# EAGLE design masterboard (EAGLE 7.0.0)
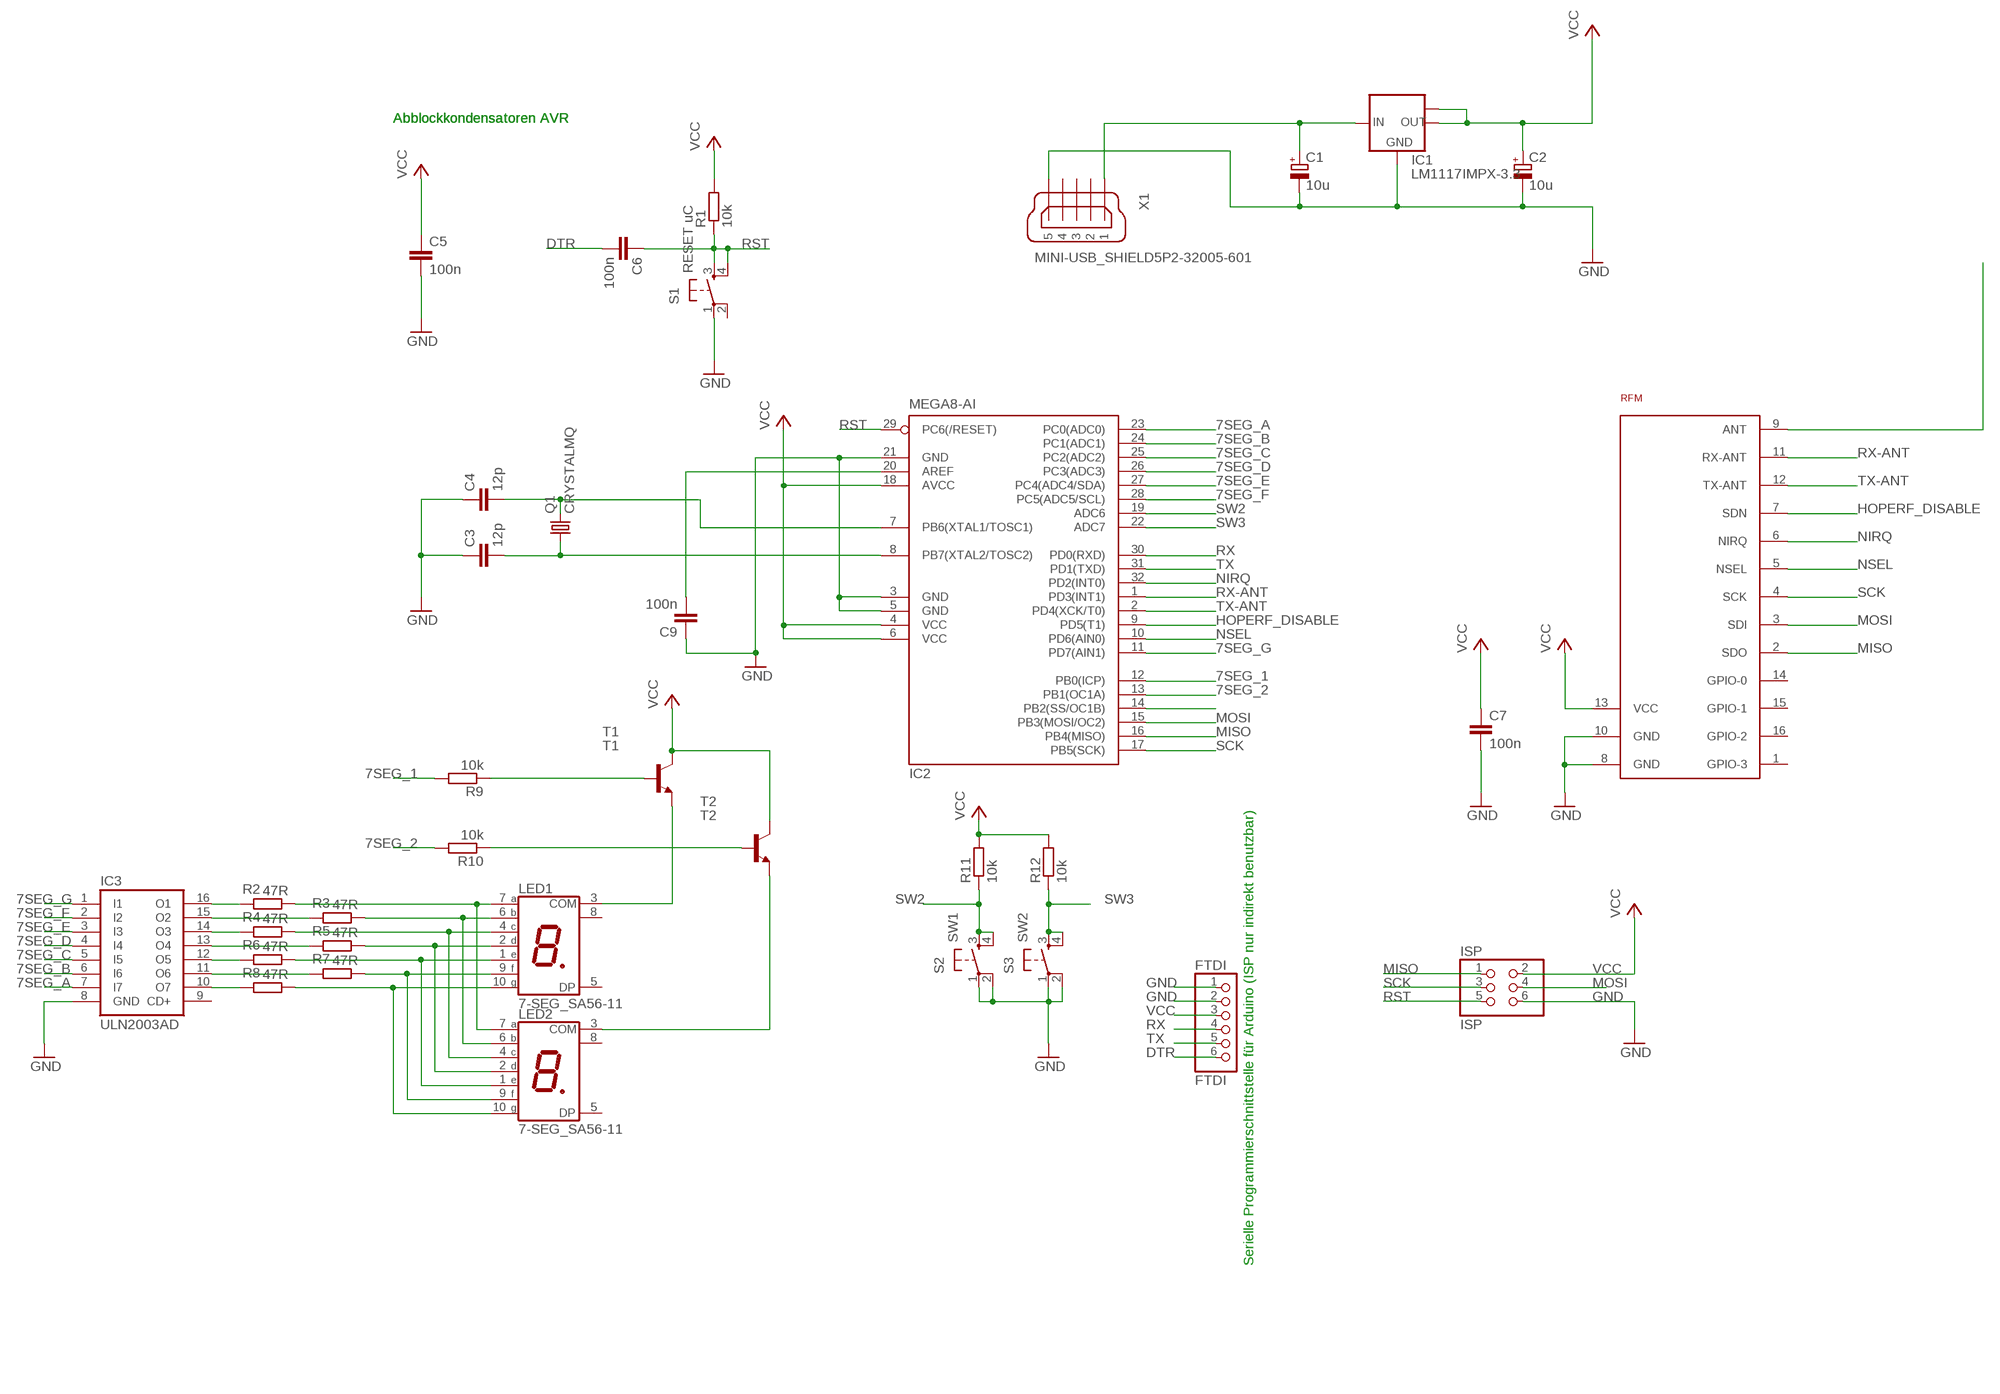
[diagram p0: schematic, sheet 1]

## Parts
C1  10u  CPOL-EUCT6032  [CT6032]
C2  10u  CPOL-EUCT6032  [CT6032]
C3  12p  C-EUC0603  [C0603]
C4  12p  C-EUC0603  [C0603]
C5  100n  C-EUC0603  [C0603]
C6  100n  C-EUC0603  [C0603]
C7  100n  C-EUC0603  [C0603]
C9  100n  C-EUC0603  [C0603]
FTDI  FTDI  PINHD-1X6/90  [1X06/90]
IC1  LM1117IMPX-3.3  [SOT223]
IC2  MEGA8-AI  [TQFP32-08]
IC3  ULN2003AD  [SO16]
ISP  ISP  PINHD-2X3  [2X03]
LED1  7-SEG_SA56-11  [SA56-11]
LED2  7-SEG_SA56-11  [SA56-11]
Q1  CRYSTALMQ  [MQ]
R1  10k  R-EU_R0805  [R0805]
R2  47R  R-EU_R0805  [R0805]
R3  47R  R-EU_R0805  [R0805]
R4  47R  R-EU_R0805  [R0805]
R5  47R  R-EU_R0805  [R0805]
R6  47R  R-EU_R0805  [R0805]
R7  47R  R-EU_R0805  [R0805]
R8  47R  R-EU_R0805  [R0805]
R9  10k  R-EU_R0805  [R0805]
R10  10k  R-EU_R0805  [R0805]
R11  10k  R-EU_R0805  [R0805]
R12  10k  R-EU_R0805  [R0805]
RFM  HOPERF-DB  [HOPERF-DB]
S1  RESET uC  10-XXB3FRAFI  [RAFI]
S2  SW1  10-XXB3FRAFI  [RAFI]
S3  SW2  10-XXB3FRAFI  [RAFI]
T1  T1  BCX54-NPN-SOT89-BCE  [SOT89-BCE]
T2  T2  BCX54-NPN-SOT89-BCE  [SOT89-BCE]
X1  MINI-USB_SHIELD5P2-32005-601  [32005-601]

## Nets
7SEG_1: IC2.12(PB0(ICP)) R9.2
7SEG_2: IC2.13(PB1(OC1A)) R10.2
7SEG_A: IC2.23(PC0(ADC0)) IC3.7(I7)
7SEG_B: IC2.24(PC1(ADC1)) IC3.6(I6)
7SEG_C: IC2.25(PC2(ADC2)) IC3.5(I5)
7SEG_D: IC2.26(PC3(ADC3)) IC3.4(I4)
7SEG_E: IC2.27(PC4(ADC4/SDA)) IC3.3(I3)
7SEG_F: IC2.28(PC5(ADC5/SCL)) IC3.2(I2)
7SEG_G: IC2.11(PD7(AIN1)) IC3.1(I1)
DTR: C6.2 FTDI.6
GND: C1.- C2.- C3.1 C4.1 C5.2 C7.2 C9.1 FTDI.1 FTDI.2 IC1.1(GND) IC2.3(GND) IC2.5(GND) IC2.21(GND) IC3.8(GND) ISP.6 RFM.8(GND) RFM.10(GND) S1.1(P) S2.1(P) S2.2(P1) S3.1(P) S3.2(P1) X1.5
HOPERF_DISABLE: IC2.9(PD5(T1)) RFM.7(SDN)
MISO: IC2.16(PB4(MISO)) ISP.1 RFM.2(SDO)
MOSI: IC2.15(PB3(MOSI/OC2)) ISP.4 RFM.3(SDI)
N$1: C3.2 IC2.8(PB7(XTAL2/TOSC2)) Q1.P1
N$2: C4.2 IC2.7(PB6(XTAL1/TOSC1)) Q1.P3
N$3: C1.+ IC1.3(IN) X1.1
N$4: IC2.14(PB2(SS/OC1B))
N$5: C9.2 IC2.20(AREF)
N$8: IC3.16(O1) R2.2
N$9: LED1.7(A) LED2.7(A) R2.1
N$10: IC3.15(O2) R3.2
N$11: LED1.6(B) LED2.6(B) R3.1
N$12: IC3.14(O3) R4.2
N$13: LED1.4(C) LED2.4(C) R4.1
N$14: IC3.13(O4) R5.2
N$15: LED1.2(D) LED2.2(D) R5.1
N$16: IC3.12(O5) R6.2
N$17: LED1.1(E) LED2.1(E) R6.1
N$18: IC3.11(O6) R7.2
N$19: LED1.9(F) LED2.9(F) R7.1
N$20: IC3.10(O7) R8.2
N$21: LED1.10(G) LED2.10(G) R8.1
N$22: LED1.3(COM) T1.E
N$24: LED2.3(COM) T2.E
N$25: R10.1 T2.B
N$26: R9.1 T1.B
N$35: RFM.9(ANT)
NIRQ: IC2.32(PD2(INT0)) RFM.6(NIRQ)
NSEL: IC2.10(PD6(AIN0)) RFM.5(NSEL)
RST: C6.1 IC2.29(PC6(/RESET)) ISP.5 R1.1 S1.3(S) S1.4(S1)
RX: FTDI.4 IC2.30(PD0(RXD))
RX-ANT: IC2.1(PD3(INT1)) RFM.11(RX-ANT)
SCK: IC2.17(PB5(SCK)) ISP.3 RFM.4(SCK)
SW2: IC2.19(ADC6) R11.1 S2.3(S) S2.4(S1)
SW3: IC2.22(ADC7) R12.1 S3.3(S) S3.4(S1)
TX: FTDI.5 IC2.31(PD1(TXD))
TX-ANT: IC2.2(PD4(XCK/T0)) RFM.12(TX-ANT)
VCC: C2.+ C5.1 C7.1 FTDI.3 IC1.2(OUT) IC1.TAB(OUT1) IC2.4(VCC) IC2.6(VCC) IC2.18(AVCC) ISP.2 R1.2 R11.2 R12.2 RFM.13(VCC) T1.C T2.C
Unconnected: IC3.9(CD+) LED1.5(DP) LED1.8(COM) LED2.5(DP) LED2.8(COM) Q1.P2(GND) Q1.P4(GND1) RFM.1(GPIO-3) RFM.14(GPIO-0) RFM.15(GPIO-1) RFM.16(GPIO-2) S1.2(P1) X1.2 X1.3 X1.4 X1.M1(S1) X1.M2(S2)

## Notes on the sheet
- Abblockkondensatoren AVR | Abblockkondensatoren AVR
- Serielle Programmierschnittstelle für Arduino (ISP nur indirekt benutzbar)

## Library data of the parts
C1 C2 = rcl:CPOL-EU: POLARIZED CAPACITOR, European symbol
C3-C7 C9 = rcl:C-EU: CAPACITOR, European symbol
FTDI = pinhead:PINHD-1X6: PIN HEADER
IC1 = lm1117:LM1117IMPX-*
IC2 = atmel:MEGA8: MICROCONTROLLER 8 Kbytes FLASH, 1 kbytes SRAM, 512 bytes EEPROM, USART, 6-channel 10 bit ADC, 2-channel 8 bit ADC Pin compatible with Atmega48, ATMega88, ATMega168 Source: avr.lbr; MPN: ATMEGA8-16AU; OC_FARNELL: 9171371; OC_NEWARK: 73M8863
IC3 = uln-udn:ULN2003A: DRIVER ARRAY
ISP = pinhead:PINHD-2X3: PIN HEADER
LED1 LED2 = display-kingbright:7-SEG_: Kingbright 14.2mm (0.56 INCH) SINGLE DIGIT NUMERIC DUISPLAY Source: SA56-11EWA(Ver1189471036.pdf; OC_FARNELL: unknown; OC_NEWARK: unknown
Q1 = Crystals-new:CRYSTAL
R1-R12 = rcl:R-EU_: RESISTOR, European symbol
RFM = hoperf_rfm24w:HOPERF-DB
S1-S3 = switch-omron:10-XX: OMRON SWITCH
T1 T2 = transistor:*-NPN-: NPN Transistror BF959 corrected 2008.03.06
X1 = con-cypressindustries:MINI-USB_SHIELD5P2-: MINI USB-B R/A DIP 5pol. Source: www.cypressindustries.com; OC_FARNELL: unknown; OC_NEWARK: unknown

## Board
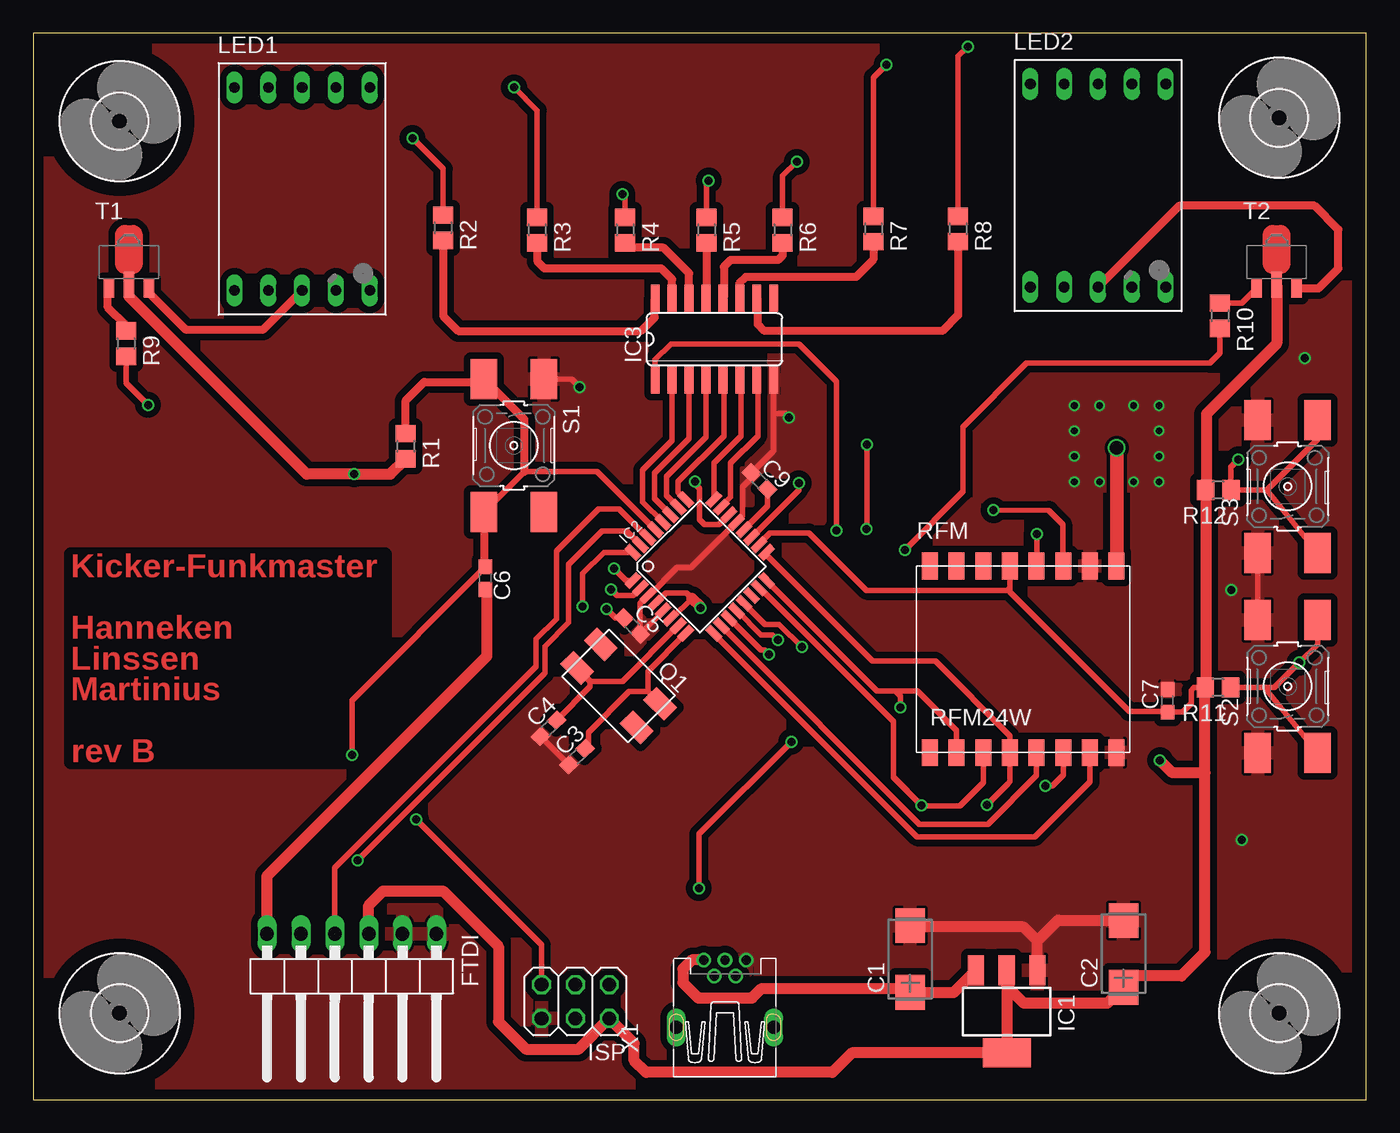
[diagram p1: board, top side]
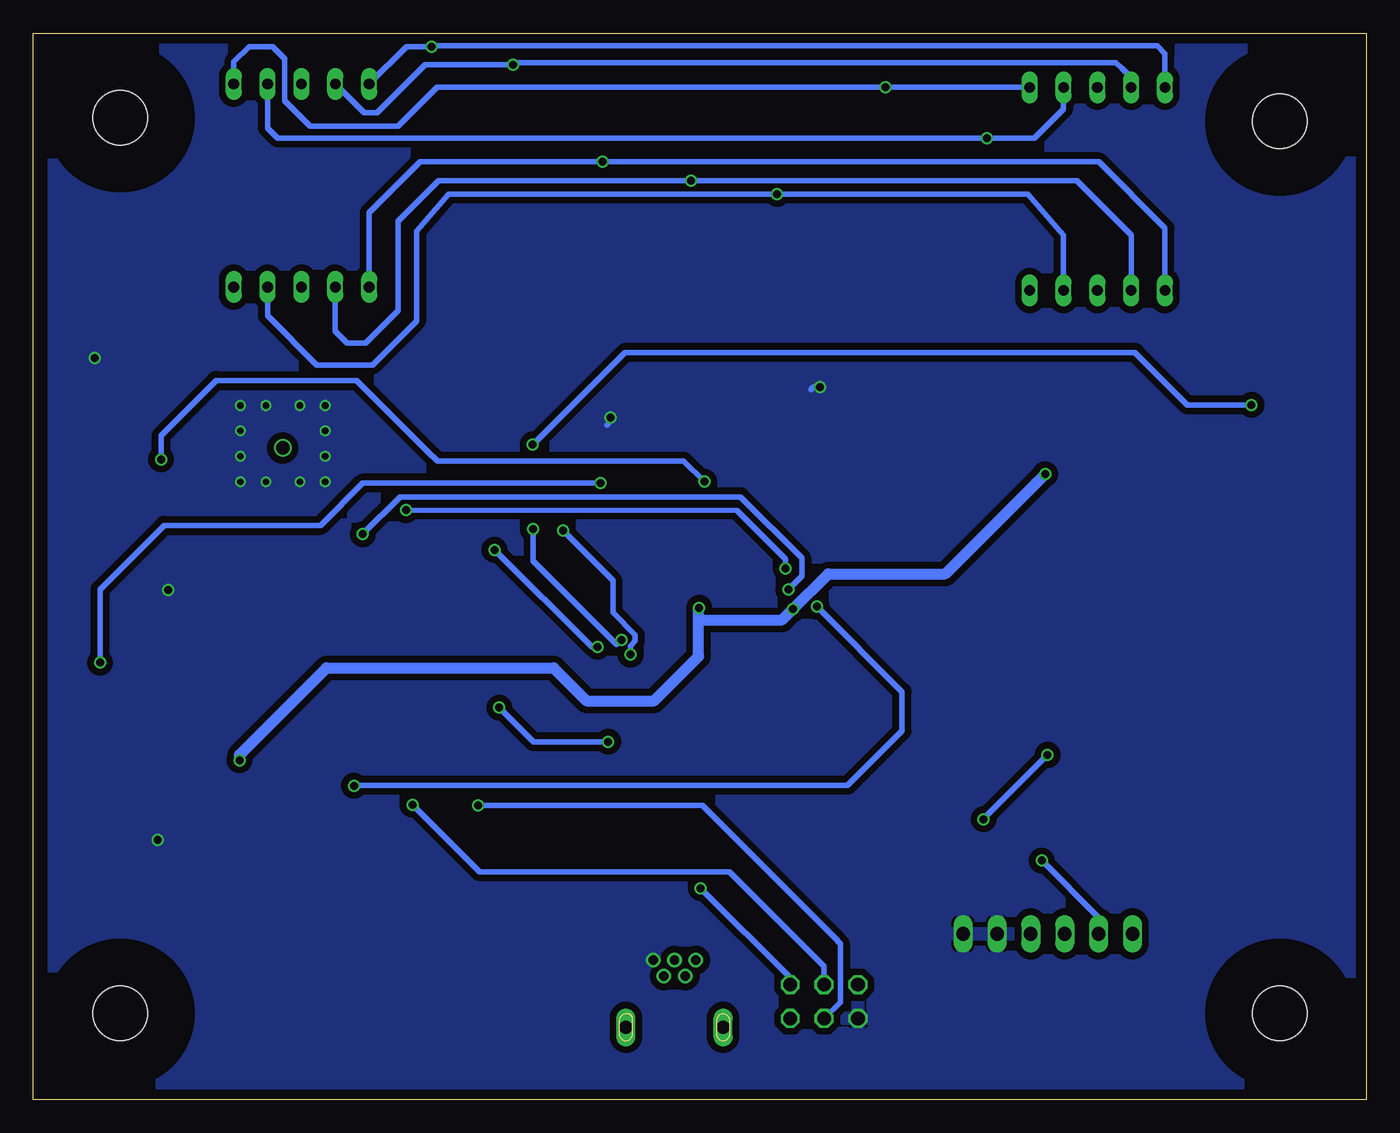
[diagram p2: board, bottom side, seen from below]

Size 100 x 80 mm. Coordinates in mm from the lower left corner, seen from the top.
Outline: 0,0 100,0 100,80 0,80 0,0
Copper layers (1*16): Top 0.035mm / dielectric 1.5mm / Bottom 0.035mm
Design rules "EAGLE Design-Rules": minimum track width 0.15mm, minimum drill 0.3mm, track to track 0.15mm, track to pad 0.15mm, pad to pad 0.15mm, via to via 0.15mm, smd to smd 0.15mm, copper to edge 0.3mm, drill to drill 0.2mm, minimum pad ring 0.2mm, minimum via ring 0.15mm, stop-mask expansion 0.075mm, vias tented up to drill 0mil, thermal gap 0.2mm

### Footprints (pad centres in the part's own frame; a part is rotated, then mirrored left to right if it is on the bottom)
CT6032 = smd 2.6 x 2.2: + -2.5,0; - 2.5,0
C0603 = smd 1.1 x 1: 1 -0.85,0; 2 0.85,0
1X06/90 = drill 1.016 long: 1 -6.35,-3.81; 2 -3.81,-3.81; 3 -1.27,-3.81; 4 1.27,-3.81; 5 3.81,-3.81; 6 6.35,-3.81
SOT223 = smd 1.219 x 2.235: 1 -2.311,-3.099; 2 0,-3.099; 3 2.311,-3.099 | smd 3.6 x 2.2: TAB 0,3.099
TQFP32-08 = smd 1.27 x 0.559: 1 -4.293,2.8; 2 -4.293,2; 3 -4.293,1.2; 4 -4.293,0.4; 5 -4.293,-0.4; 6 -4.293,-1.2; 7 -4.293,-2; 8 -4.293,-2.8; 17 4.293,-2.8; 18 4.293,-2; 19 4.293,-1.2; 20 4.293,-0.4; 21 4.293,0.4; 22 4.293,1.2; 23 4.293,2; 24 4.293,2.8 | smd 0.559 x 1.27: 9 -2.8,-4.293; 10 -2,-4.293; 11 -1.2,-4.293; 12 -0.4,-4.293; 13 0.4,-4.293; 14 1.2,-4.293; 15 2,-4.293; 16 2.8,-4.293; 25 2.8,4.293; 26 2,4.293; 27 1.2,4.293; 28 0.4,4.293; 29 -0.4,4.293; 30 -1.2,4.293; 31 -2,4.293; 32 -2.8,4.293
SO16 = smd 0.66 x 2.032: 1 -4.445,-3.073; 2 -3.175,-3.073; 3 -1.905,-3.073; 4 -0.635,-3.073; 5 0.635,-3.073; 6 1.905,-3.073; 7 3.175,-3.073; 8 4.445,-3.073; 9 4.445,3.073; 10 3.175,3.073; 11 1.905,3.073; 12 0.635,3.073; 13 -0.635,3.073; 14 -1.905,3.073; 15 -3.175,3.073; 16 -4.445,3.073
2X03 = drill 1.016 octagon: 1 -2.54,-1.27; 2 -2.54,1.27; 3 0,-1.27; 4 0,1.27; 5 2.54,-1.27; 6 2.54,1.27
SA56-11 = drill 0.8 long: 1 -5.08,-7.62; 2 -2.54,-7.62; 3 0,-7.62; 4 2.54,-7.62; 5 5.08,-7.62; 6 5.08,7.62; 7 2.54,7.62; 8 0,7.62; 9 -2.54,7.62; 10 -5.08,7.62
MQ = smd 2.2 x 1.4: P1 -3.15,-1.25; P2 3.15,-1.25; P3 3.15,1.25; P4 -3.15,1.25
R0805 = smd 1.3 x 1.5: 1 -0.95,0; 2 0.95,0
HOPERF-DB = smd 1.2 x 2: 1 1,0; 2 3,0; 3 5,0; 4 7,0; 5 9,0; 6 11,0; 7 13,0; 8 15,0; 9 15,14; 10 13,14; 11 11,14; 12 9,14; 13 7,14; 14 5,14; 15 3,14; 16 1,14
RAFI = smd 3 x 2: 1 -5,2.25; 2 5,2.25; 3 -5,-2.25; 4 5,-2.25
SOT89-BCE = smd 0.8 x 1.4: B -1.499,-1.981; E 1.499,-1.981 | smd 0.8 x 1.9: C 0,-1.727
4,1 = hole 4.1: 0,0
32005-601 = drill 0.7 pad 1.016: 1 2.825,1.6; 2 1.625,0.8; 3 2.825,0; 4 1.625,-0.8; 5 2.825,-1.6 | drill 1 pad 1.422 long: M1 -2.225,3.65; M2 -2.225,-3.65

### Placement (x,y rotation side)
C1  65.79,10.54 90 top
C2  81.79,10.92 90 top
C3  40.79,25.72 45 top
C4  38.66,27.86 45 top
C5  44.93,35.53 315 top
C6  33.91,39.12 270 top
C7  85.09,29.92 90 top
C9  54.48,46.41 315 top
FTDI  23.89,8.62 180 top
IC1  73.03,6.6 180 top
IC2  50,40 45 top
IC3  51.1,57.05 0 top
ISP  40.67,7.35 180 top
LED1  20.17,68.33 0 top
LED2  79.88,68.58 0 top
Q1  43.92,31.04 135 top
R1  27.94,49.02 270 top
R2  30.74,65.41 270 top
R3  37.81,65.24 270 top
R4  44.41,65.24 270 top
R5  50.51,65.24 270 top
R6  56.22,65.24 270 top
R7  63.03,65.32 270 top
R8  69.38,65.32 270 top
R9  6.96,56.72 270 top
R10  89.03,58.8 270 top
R11  88.88,30.91 180 top
R12  88.9,45.72 180 top
RFM  66.27,26.04 0 top
S1  36.05,49.07 270 top
S2  94.11,31 90 top
S3  94.11,46 90 top
T1  7.17,62.85 0 top
T2  93.28,62.85 0 top
U$2  [4,1]  93.47,73.66 0 top
U$3  [4,1]  93.47,6.48 0 top
U$4  [4,1]  6.48,6.48 0 top
U$5  [4,1]  6.48,73.41 0 top
X1  51.89,7.64 90 top

### Tracks (layer width: path | path; a pad name or v marks a point on that pad's centre or on a via)
7SEG_1  (via drill 0.6)
  Top 0.406: R9.2 6.96,53.77 v8.61,52.12 | v62.53,49.15 62.53,42.82 v62.51,42.8 | IC2.12 52.78,36.68 54.59,34.87 55.47,34.87 v55.85,34.49
  Bottom 0.406: v8.61,52.12 13.41,52.12 17.35,56.06 55.6,56.06 62.51,49.15 v62.53,49.15 | v62.51,42.8 62.51,40.41 56.24,34.14 55.88,34.49 v55.85,34.49
7SEG_2  (via drill 0.6)
  Top 0.406: IC2.13 53.32,37.23 54.89,35.66 55.96,35.66 v57.66,33.96 | v65.41,41.25 69.75,45.62 69.75,50.47 74.52,55.24 88.27,55.24 89.03,56.01 R10.2
  Bottom 0.406: v57.66,33.96 58.09,33.96 v65.41,41.25
7SEG_A
  Top 0.406: IC2.23 51.62,44.51 52.32,45.21 52.32,47.75 54.36,49.78 54.36,53.9 IC3.7
7SEG_B
  Top 0.406: IC2.24 51.05,47.75 53.09,49.78 53.09,53.9 IC3.6
7SEG_C
  Top 0.406: IC2.25 48.95,45.03 48.39,45.59 48.39,46.35 51.82,49.78 51.82,53.9 IC3.5
7SEG_D
  Top 0.406: IC3.4 50.47,49.71 47.5,46.74 47.5,45.33 IC2.26
7SEG_E
  Top 0.406: IC3.3 49.2,49.58 46.61,46.99 46.61,45.09 IC2.27
7SEG_F
  Top 0.406: IC3.2 47.93,49.45 45.72,47.24 45.72,44.85 IC2.28
7SEG_G  (via drill 0.6)
  Top 0.406: IC3.1 46.66,55.52 47.83,56.69 57.45,56.69 60.27,53.87 v60.27,42.7 | IC2.11 54.59,33.73 54.84,33.73 v55.19,33.38
  Bottom 0.406: v60.27,42.7 56.52,38.94 56.52,36.52 54.84,34.85 54.84,34.39 55.19,34.04 v55.19,33.38
DTR
  Top 0.813: FTDI.6 17.54,16.78 34.04,33.27 34.04,38.14 C6.2
GND  (via drill 0.5, 0.6)
  Top 0.406: C4.1 C3.1 | IC3.8 55.55,51.46 | 55.55,51.46 55.55,48.64 | 55.48,48.61 C9.1 53.88,46.64 53.21,45.97 53.21,43.78 IC2.21 49.34,39.9 48.31,39.9 46.22,37.81 IC2.3 45.53,37.23 C5.2 47.2,36.6 47.2,36.68 IC2.5 | RFM.10 | 38.37,54.07 S1.1 40.37,54.07 v41,53.44 | 55.55,51.46 56.41,51.46 v56.69,51.18 | S2.1 92.06,26.7 91.39,26.7 | S2.2 S3.1
  Top 0.813: 75.49,9.7 IC1.1 75.34,11.91 | C2.- 81.75,13.46 76.89,13.46 75.34,11.91 | 75.34,11.91 74.3,12.95 65.87,12.95 C1.-
  Bottom 0.406: v56.69,51.18 56.69,50.9 56.97,50.62 | v41,53.44 41.48,53.44 41.66,53.26
  other vias: 78.11,46.35 80.01,46.35 82.55,46.35 84.45,46.35 84.45,48.26 84.45,50.16 84.45,52.07 82.55,52.07 78.11,48.26 78.11,50.16 78.11,52.07 80.01,52.07 95.4,55.63 89.89,38.23 90.65,19.48
  pour Bottom (isolate 0.508): 1.27,1.27 98.42,1.27 98.42,7.62 98.42,78.74 1.27,78.74 1.27,68.58
  pour Top (isolate 0.254): 77.47,45.72 85.09,45.72 85.09,52.7 77.47,52.7
  pour Top (isolate 0.508, rank 6): 1.27,1.27 98.42,1.27 98.42,78.74 1.27,78.74 1.27,69.22
HOPERF_DISABLE
  Top 0.406: IC2.9 51.05,34.95 66.29,19.71 75.16,19.71 79.27,23.82 RFM.7
MISO  (via drill 0.6)
  Top 0.406: IC2.16 63.3,30.66 64.67,30.66 | 64.67,30.66 66.32,30.66 69.27,27.71 RFM.2 | v49.94,15.85 49.94,19.91 v56.87,26.85 | v65.05,29.41 65.05,30.28 64.67,30.66
  Bottom 0.406: ISP.1 43.21,9.12 v49.94,15.85 | v56.87,26.85 62.48,26.85 v65.05,29.41
MOSI  (via drill 0.6)
  Top 0.406: IC2.15 54.51,38.38 64.52,28.37 64.52,24.21 | 64.52,24.21 66.67,22.05 69.52,22.05 71.27,23.8 RFM.3 | 64.52,24.21 64.52,24.18 v66.62,22.07
  Bottom 0.406: v66.62,22.07 49.81,22.07 39.67,11.94 39.67,11.91 39.45,11.68 39.45,7.3 ISP.4
N$1
  Top 0.406: IC2.8 46.1,32.13 46.1,30.63 Q1.P1 47.01,29.7 46.1,30.61 44.7,30.61 41.66,27.56 41.66,26.59 C3.2
N$2
  Top 0.406: IC2.7 44.2,31.37 41.82,31.37 Q1.P3 40.81,32.34 41.78,31.37 41.78,30.98 C4.2
N$3
  Top 0.813: IC1.3 69.05,8.04 C1.+ 65.5,8.33 54.63,8.33 53.92,7.62 49.89,7.62 48.74,8.76 48.74,9.8 49.4,10.46 X1.1
N$5
  Top 0.406: C9.2 55.08,44.52 IC2.20
N$8
  Top 0.61: R2.2 30.74,58.79 31.88,57.66 45.59,57.66 46.61,58.67 46.61,60.07 IC3.16
N$9  (via drill 0.6)
  Top 0.406: R2.1 30.74,69.84 v28.45,72.14
  Bottom 0.406: LED1.7 22.71,74.32 24.89,72.14 v28.45,72.14 81.66,72.14 82.42,72.9 LED2.7
N$10
  Top 0.61: IC3.15 47.93,61.54 47.12,62.36 38.35,62.36 37.85,62.87 37.85,64.25 R3.2
N$11  (via drill 0.6)
  Top 0.406: R3.1 37.81,74.21 v36.07,75.95
  Bottom 0.406: LED1.6 v36.07,75.95 69.72,75.95 72.64,73.03 79.25,73.03 81.15,74.93 81.15,78.11 82.04,78.99 83.82,78.99 84.96,77.85 LED2.6
N$12
  Top 0.61: IC3.14 49.2,62 47.3,63.91 44.79,63.91 R4.2
N$13  (via drill 0.6)
  Top 0.406: R4.1 44.41,67.73 v44.2,67.94
  Bottom 0.406: LED1.4 22.71,64.87 25.4,67.94 v44.2,67.94 68.83,67.94 71.25,65.15 71.25,58.42 74.55,55.12 78.74,55.12 82.42,58.8 LED2.4
N$14
  Top 0.61: R5.2 50.51,60.16 IC3.13
N$15  (via drill 0.6)
  Top 0.406: R5.1 50.51,68.8 v50.67,68.96
  Bottom 0.406: LED1.2 17.63,64.87 21.72,68.96 v50.67,68.96 69.6,68.96 72.64,65.91 72.64,59.18 75.06,56.77 76.45,56.77 77.34,57.66 LED2.2
N$16
  Top 0.61: R6.2 56.22,63.34 55.88,62.99 52.32,62.99 51.82,62.48 51.82,60.2 IC3.12
N$17  (via drill 0.6)
  Top 0.406: R6.1 56.22,69.3 v57.28,70.36
  Bottom 0.406: LED1.1 15.09,65.38 20.07,70.36 v57.28,70.36 70.99,70.36 74.8,66.55 LED2.1
N$18
  Top 0.61: R7.2 63.03,63.03 61.72,61.72 53.47,61.72 52.96,61.21 52.96,60.17 IC3.11
N$19  (via drill 0.6)
  Top 0.406: R7.1 63.03,76.67 v64.01,77.65
  Bottom 0.406: LED2.9 75.18,74.04 74.22,74.04 70.61,77.65 v64.01,77.65 63.86,77.8 18.77,77.8 18.34,77.37 18.31,77.37 17.63,76.68 LED1.9
N$20
  Top 0.61: R8.2 69.38,58.84 68.2,57.66 54.86,57.66 54.36,58.17 54.36,60.05 IC3.10
N$21  (via drill 0.6)
  Top 0.406: R8.1 69.38,78.27 v70.1,78.99
  Bottom 0.406: LED2.10 72.01,78.99 v70.1,78.99 70.03,79.07 15.67,79.07 15.09,78.49 LED1.10
N$22
  Top 0.61: T1.E 8.67,60.55 11.43,57.78 17.25,57.78 LED1.3
N$24
  Top 0.61: T2.E 96.43,60.87 97.92,62.36 97.92,65.28 96.14,67.06 85.98,67.06 LED2.3
N$25
  Top 0.406: R10.1 90.66,59.75 T2.B
N$26
  Top 0.61: R9.1 6.96,58.06 5.59,59.44 5.59,60.79 T1.B
N$35  (via drill 1)
  Top 1.016: RFM.9 v81.28,48.9
NIRQ  (via drill 0.6)
  Top 0.406: IC2.32 42.81,41.05 41.22,39.47 v41.22,36.98 | v75.95,23.55 76.45,23.55 77.27,24.36 RFM.6
  Bottom 0.406: v75.95,23.55 75.92,23.57 38.91,23.57 34.82,27.66 34.82,30.58 v41.22,36.98
NSEL
  Top 0.406: IC2.10 51.62,35.53 66.5,20.65 71.6,20.65 75.26,24.31 75.26,26.03 RFM.5
RST  (via drill 0.6)
  Top 0.406: IC2.29 46.66,42.75 42.29,47.12 36.85,47.12 S1.4 | ISP.5 38.13,11.6 v28.7,21.03 | v23.9,25.86 23.9,29.96 C6.1
  Top 0.61: S1.4 33.8,40.07 C6.1 | R1.1 27.94,52.45 29.34,53.85 34.16,53.85 34.29,53.98 33.9,53.98 S1.3 36.85,51.02 36.85,47.12
  Bottom 0.406: v28.7,21.03 28.7,21.06 v23.9,25.86
RX  (1 unrouted)
  Top 0.406: IC2.30 46.08,42.19 43.94,44.32 42.42,44.32 39.24,41.15 39.24,36.07 37.72,34.54 37.72,32.51 22.61,17.4 22.61,12.44
RX-ANT  (via drill 0.6)
  Top 0.406: IC2.1 44.47,38.95 v43.56,39.85 | RFM.11 77.24,40.06 77.24,43.16 76.2,44.2 v72.03,44.22
  Bottom 0.406: v43.56,39.85 43.56,40.54 47.22,44.2 v72.03,44.22
SCK  (via drill 0.6)
  Top 0.406: IC2.17 55.02,40.84 62.97,32.89 67.67,32.89 73.28,27.28 RFM.4 73.28,26.02 73.28,23.88 73.1,23.7 73.1,23.67 v71.55,22.12
  Bottom 0.406: ISP.3 40.67,9.99 47.78,17.09 66.52,17.09 v71.55,22.12
SW2  (via drill 0.6)
  Top 0.406: R11.1 92.34,30.91 | 92.34,30.91 S2.3 | v95,32.79 | IC2.19 57.43,45.73 v57.43,46.25 | 92.34,30.91 93.11,30.91 v95,32.79 | S2.4 96.36,34.16 v95,32.79
  Bottom 0.406: v95,32.79 95,38.28 90.19,43.08 78.46,43.08 75.29,46.25 v57.43,46.25
SW3  (via drill 0.6)
  Top 0.406: 92.53,45.72 R12.1 89.85,47.46 v90.42,48.03 | 92.53,45.72 S3.3 | v49.66,46.35 49.66,46.18 49.99,45.85 49.99,43.54 50.37,43.16 51.46,43.16 IC2.22 | S3.4 96.36,49.55 92.53,45.72
  Bottom 0.406: v90.42,48.03 90.42,49.81 86.28,53.95 75.74,53.95 70.08,48.28 70.05,48.28 69.67,47.9 51.21,47.9 v49.66,46.35
TX  (via drill 0.6)
  Top 0.406: v24.33,17.93 38.33,31.93 38.33,31.95 38.38,32 38.38,34.01 40.16,35.79 40.16,40.13 42.67,42.65 44.52,42.65 IC2.31 45.53,41.62 45.52,41.6
  Bottom 0.406: FTDI.5 20.08,13.68 v24.33,17.93
TX-ANT  (via drill 0.6)
  Top 0.406: v43.36,38.25 43.79,37.82 44.99,37.82 IC2.2 | v75.29,42.42 75.29,40.05 RFM.12
  Bottom 0.406: v43.36,38.25 42.34,39.27 42.34,40.62 46.94,45.21 72.49,45.21 v75.29,42.42
VCC  (via drill 0.6)
  Top 0.406: 73.25,38.38 73.25,38.08 82.22,29.11 85.05,29.11 C7.1 85.1,29.08 86.23,29.08 86.87,29.72 86.87,30.71 87.07,30.91 R11.2 | 73.25,38.38 73.25,40.02 RFM.13 73.28,40.05 | IC2.18 54.45,41.7 55.27,42.52 58.19,42.52 62.51,38.2 73.08,38.2 73.25,38.38 | IC2.4 46.72,37.25 47.47,38 49.02,38 49.42,37.6 47.93,36.12 IC2.6 | C5.1 43.67,36.14 v43,36.8
  Top 0.61: ISP.2 43.32,6.08 45.09,4.32 | 88.01,45.78 R12.2 | 87.95,30.93 R11.2 | 82.64,9.27 C2.+
  Top 0.813: T2.C 93.28,56.7 88.01,51.44 88.01,45.78 | R12.2 87.95,30.93 | 82.64,9.27 86.13,9.27 87.91,11.05 87.91,24.51 | C2.+ 80.61,7.24 74.3,7.24 73.03,8.51 IC1.2 IC1.TAB 61.42,3.5 59.94,2.03 45.97,2.03 45.09,2.92 45.09,4.21 ISP.2 40.91,3.79 36.96,3.79 34.9,5.84 34.9,11.48 30.73,15.65 26.24,15.65 25.16,14.57 FTDI.3 | 87.91,24.51 87.91,30.89 R11.2 | T1.C 7.17,60.27 20.52,46.91 v24.08,46.91 26.78,46.91 R1.2 | 87.91,24.51 85.47,24.51 v84.53,25.45 | v50.04,36.88 50.04,36.98 49.42,37.6
  Bottom 0.813: v84.53,25.45 84.53,25.86 78,32.38 60.96,32.38 58.5,29.92 53.42,29.92 50.09,33.25 50.09,35.99 | 50.09,35.99 50.09,36.83 v50.04,36.88 | 50.09,35.99 43.81,35.99 v43,36.8 40.36,39.45 31.57,39.45 24.79,46.23 | 24.79,46.23 24.08,46.94 | 24.79,46.23 24.77,46.23 v24.08,46.91

### Text on the board
Top: Kicker-Funkmaster / / Hanneken / Linssen / Martinius / / rev B